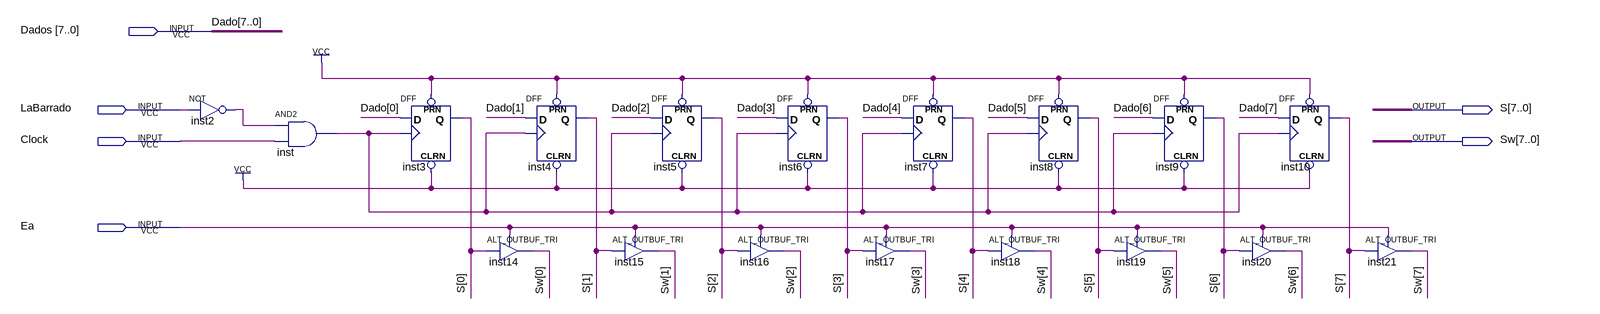
[diagram p0: schematic sheet]
// Quartus schematic Acumulador.bdf as structural Verilog: 18 symbols, 6 pins
module Acumulador (
  input  [7:0] Dados,
  input  LaBarrado,
  input  Clock,
  input  Ea,
  output [7:0] S,
  output [7:0] Sw
);

  wire inst2_out, inst_out;

  not inst2 (inst2_out, LaBarrado);
  and inst (inst_out, inst2_out, Clock);
  DFF inst3 (.CLRN(1'b1), .CLK(inst_out), .D(Dados[0]), .PRN(1'b1), .Q(S[0]));
  ALT_OUTBUF_TRI inst14 (.i(S[0]), .oe(Ea), .o(Sw[0]));
  DFF inst4 (.CLRN(1'b1), .CLK(inst_out), .D(Dados[1]), .PRN(1'b1), .Q(S[1]));
  ALT_OUTBUF_TRI inst15 (.i(S[1]), .oe(Ea), .o(Sw[1]));
  DFF inst5 (.CLRN(1'b1), .CLK(inst_out), .D(Dados[2]), .PRN(1'b1), .Q(S[2]));
  ALT_OUTBUF_TRI inst16 (.i(S[2]), .oe(Ea), .o(Sw[2]));
  DFF inst6 (.CLRN(1'b1), .CLK(inst_out), .D(Dados[3]), .PRN(1'b1), .Q(S[3]));
  ALT_OUTBUF_TRI inst17 (.i(S[3]), .oe(Ea), .o(Sw[3]));
  DFF inst7 (.CLRN(1'b1), .CLK(inst_out), .D(Dados[4]), .PRN(1'b1), .Q(S[4]));
  ALT_OUTBUF_TRI inst18 (.i(S[4]), .oe(Ea), .o(Sw[4]));
  DFF inst8 (.CLRN(1'b1), .CLK(inst_out), .D(Dados[5]), .PRN(1'b1), .Q(S[5]));
  ALT_OUTBUF_TRI inst19 (.i(S[5]), .oe(Ea), .o(Sw[5]));
  DFF inst9 (.CLRN(1'b1), .CLK(inst_out), .D(Dados[6]), .PRN(1'b1), .Q(S[6]));
  ALT_OUTBUF_TRI inst20 (.i(S[6]), .oe(Ea), .o(Sw[6]));
  DFF inst10 (.CLRN(1'b1), .CLK(inst_out), .D(Dados[7]), .PRN(1'b1), .Q(S[7]));
  ALT_OUTBUF_TRI inst21 (.i(S[7]), .oe(Ea), .o(Sw[7]));

  // Other names for the same wires on the sheet: Dado[7:0] = Dados
endmodule
